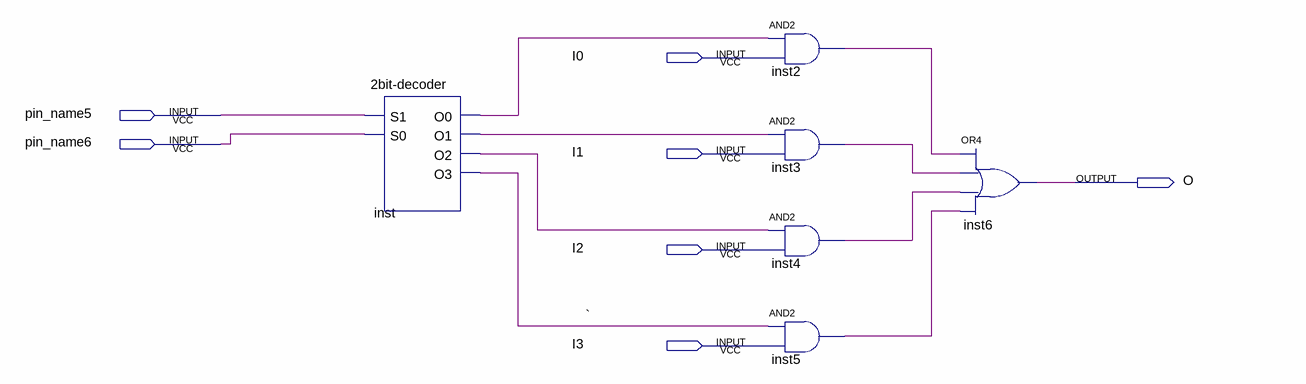
[diagram p0: schematic sheet]
// Quartus schematic 4-1Multiplexer.bdf as structural Verilog: 6 symbols, 7 pins
module \4-1Multiplexer  (
  input  I0,
  input  pin_name5,
  input  pin_name6,
  input  I1,
  input  I2,
  input  I3,
  output O
);

  wire \` , inst2_out, inst3_out, inst4_out, inst5_out, inst_o0, inst_o1, inst_o2;

  \2bit-decoder  inst (.S1(pin_name5), .S0(pin_name6), .O0(inst_o0), .O1(inst_o1), .O2(inst_o2), .O3(\` ));
  and inst2 (inst2_out, inst_o0, I0);
  and inst3 (inst3_out, inst_o1, I1);
  and inst4 (inst4_out, inst_o2, I2);
  and inst5 (inst5_out, \` , I3);
  or inst6 (O, inst2_out, inst3_out, inst4_out, inst5_out);
endmodule
